# Altium schematic sheet Perifericos.SchDoc
size A4
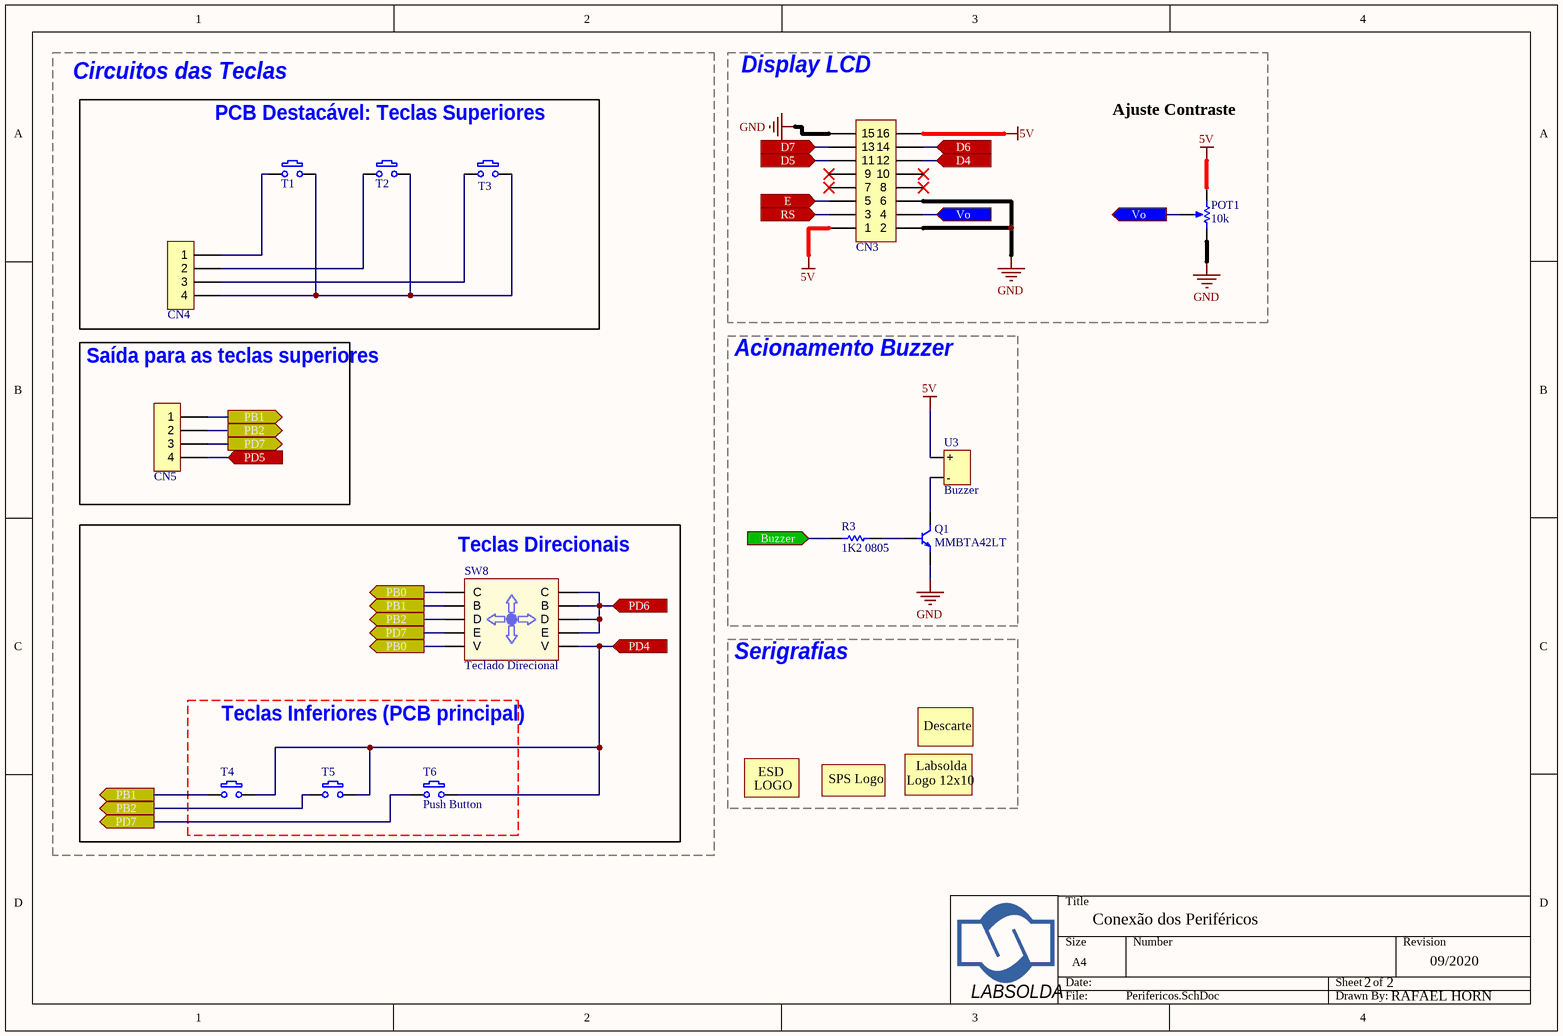
[diagram p0: Perifericos.SchDoc]

## Parts
CN3  Header 16 Vias  [Header 16 180º PCI]  (value not drawn)
CN4  KK 4 Vias  [KK_4W_.100]  (value not drawn)
CN5  KK 4 Vias  [KK_4W_.100]  (value not drawn)
Logo1  ESD 7x6  [ESD 7x6]  (value not drawn)  (no BOM)
Logo2  SPS  [SPS]  (value not drawn)  (no BOM)
Logo3  Labsolda12x10  [LABSOLDA 12x10]  (value not drawn)  (no BOM)
Logo4  Descarte  [DESCARTE7x7]  (value not drawn)  (no BOM)
POT1  10k  [3386]
Q1  MMBTA42LT  [SOT-23]
R3  1K2 0805  [0805 - 1K2 1%]
SW8  Teclado Direcional  [Teclado_Direcional]
T1  Push Button  [Chave Tactil 6x6x5]  (value not drawn)
T2  Push Button  [Chave Tactil 6x6x5]  (value not drawn)
T3  Push Button  [Chave Tactil 6x6x5]  (value not drawn)
T4  Push Button  [Chave Tactil 6x6x5]  (value not drawn)
T5  Push Button  [Chave Tactil 6x6x5]  (value not drawn)
T6  Push Button  [Chave Tactil 6x6x5]
U3  Buzzer  [Buzzer]

## Blocks framed on the sheet
Display LCD: CN3 POT1
PCB Destacável: Teclas Superiores: CN4 T1-T3
Saída para as teclas superiores: CN5
Acionamento Buzzer: Q1 R3 U3
Teclas Direcionais: SW8
Serigrafias: Logo1-Logo4
Teclas Inferiores (PCB principal): T4-T6

## Ports
Buzzer (in), D4 (in), D5 (in), D6 (in), D7 (in), E (in), PB0 (out), PB1 (out), PB2 (out), PD4 (in), PD5 (in), PD6 (in), PD7 (out), RS (in), Vo (in), Vo (out)

## Nets
5V: CN3.1 CN3.16 POT1.1(TOP) U3.1(+)
GND: CN3.2 CN3.6 CN3.15 POT1.2(BOT) Q1.E
Buzzer: R3.1 ; port Buzzer
D4: CN3.12 ; port D4
D5: CN3.11 ; port D5
D6: CN3.14 ; port D6
D7: CN3.13 ; port D7
E: CN3.5 ; port E
PB0: SW8.1(C) SW8.9(V) ; port PB0
PB1: CN5.1 SW8.3(B) T4.1 ; port PB1
PB2: CN5.2 SW8.5(D) T5.1 ; port PB2
PD4: SW8.10(V) T4.2 T5.2 T6.2 ; port PD4
PD5: CN5.4 ; port PD5
PD6: SW8.2(C) SW8.4(B) SW8.6(D) SW8.8(E) ; port PD6
PD7: CN5.3 SW8.7(E) T6.1 ; port PD7
RS: CN3.3 ; port RS
Vo: CN3.4 POT1.3(TAP) ; port Vo
NetCN4_1: CN4.1 T1.2
NetCN4_2: CN4.2 T2.2
NetCN4_3: CN4.3 T3.1
NetCN4_4: CN4.4 T1.1 T2.1 T3.2
NetQ1_B: Q1.B R3.2
NetQ1_C: Q1.C U3.2(-)

Not connected (* = marked no-connect by the designer): CN3 7* 8* 9* 10*

## Notes on the sheet
- Circuitos das Teclas
- Ajuste Contraste
- Conexão dos Periféricos
- 2
- 09/2020
- LABSOLDA
- RAFAEL HORN
- (in symbol ESD 7x6) ESD; LOGO
- (in symbol Labsolda12x10) Labsolda; Logo 12x10
- (in symbol SPS) SPS Logo

## Library data of the parts
CN3 = Header 16 180º: Conector Placa Macho 16 Vias C/ guia 180º 2.54mm
CN4 CN5 = KK 4 Vias: Conector Placa KK 4 Vias 2.54mm
POT1 = Pot_3386: Trimpot Horizontal 3386
Q1 = MMBTA42LT: High Voltage Transistors NPN Silicon 300V 500mA
R3 = 1K2 - 0805: Resistor SMD 0805 1K2
SW8 = Teclado Direcional: Teclado Direcional associando botões Multimec
T1-T6 = Push Button: Chave Tactil 4 terminais 6x6x5mm - KFC-A06
U3 = Buzzer 5V: Buzzers Indicator, Internally Driven Magnetic 5V 30mA 2.73kHz 82dB @ 5V, 10cm Through Hole PC Pins; Partnumber: AI-1027-TWT-5V-2-R